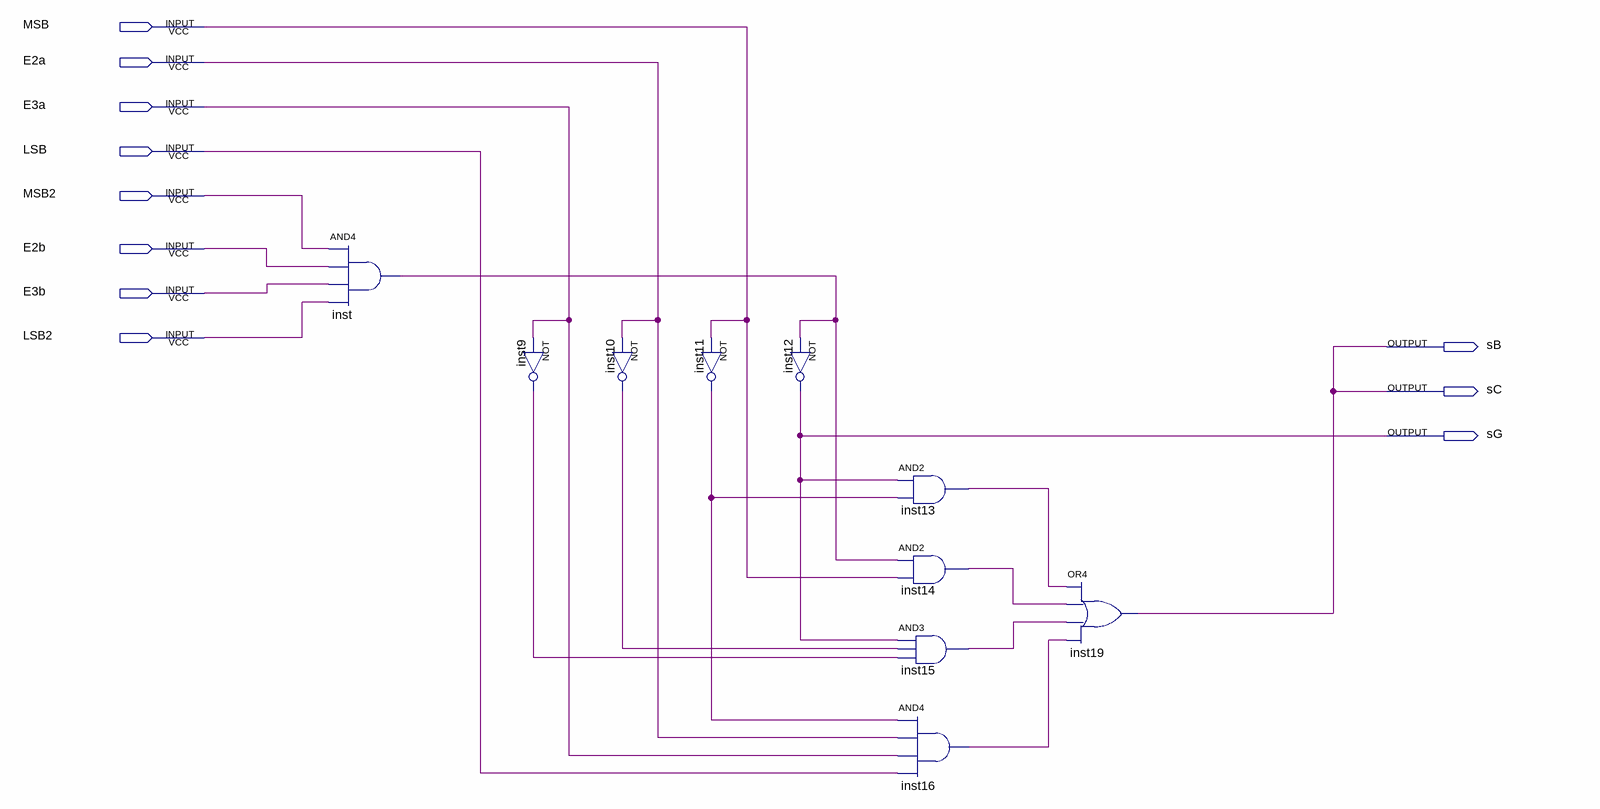
[diagram p0: schematic sheet]
// Quartus schematic decodificadorSomaDezenaSinal.bdf as structural Verilog: 10 symbols, 11 pins
module decodificadorSomaDezenaSinal (
  input  MSB,
  input  E2a,
  input  E3a,
  input  LSB,
  input  MSB2,
  input  E2b,
  input  E3b,
  input  LSB2,
  output sB,
  output sC,
  output sG
);

  wire inst9_out, inst10_out, inst11_out, inst13_out, inst14_out, inst15_out, inst16_out, inst_out;

  and inst (inst_out, MSB2, E2b, E3b, LSB2);
  not inst9 (inst9_out, E3a);
  not inst10 (inst10_out, E2a);
  not inst11 (inst11_out, MSB);
  not inst12 (sG, inst_out);
  and inst13 (inst13_out, sG, inst11_out);
  and inst14 (inst14_out, inst_out, MSB);
  and inst15 (inst15_out, sG, inst10_out, inst9_out);
  and inst16 (inst16_out, inst11_out, E2a, E3a, LSB);
  or inst19 (sB, inst13_out, inst14_out, inst15_out, inst16_out);

  assign sC = sB;
endmodule
